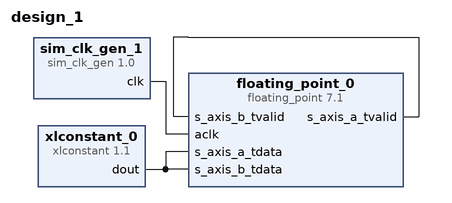
[diagram p0: block diagram of the top level]
# Vivado block design design_1, xc7vx485tffg1157-1, Vivado 2018.3
create_bd_design design_1

create_bd_cell -type ip -vlnv xilinx.com:ip:floating_point:7.1 floating_point_0
set_property -dict [list \
  CONFIG.Add_Sub_Value Add \
  CONFIG.C_Latency 11 \
  CONFIG.Flow_Control NonBlocking \
  CONFIG.Has_RESULT_TREADY false \
] [get_bd_cells floating_point_0]
create_bd_cell -type ip -vlnv xilinx.com:ip:sim_clk_gen:1.0 sim_clk_gen_1
create_bd_cell -type ip -vlnv xilinx.com:ip:xlconstant:1.1 xlconstant_0
set_property -dict {CONFIG.CONST_VAL 16 CONFIG.CONST_WIDTH 32} [get_bd_cells xlconstant_0]

# ---- connections ----

connect_bd_net [get_bd_pins sim_clk_gen_1/clk] [get_bd_pins floating_point_0/aclk]
connect_bd_net [get_bd_pins floating_point_0/s_axis_a_tvalid] [get_bd_pins floating_point_0/s_axis_b_tvalid]
connect_bd_net [get_bd_pins xlconstant_0/dout] [get_bd_pins floating_point_0/s_axis_a_tdata] [get_bd_pins floating_point_0/s_axis_b_tdata]

validate_bd_design
save_bd_design
